# Altium project Gas_sensors_Rev. A.PrjPcb
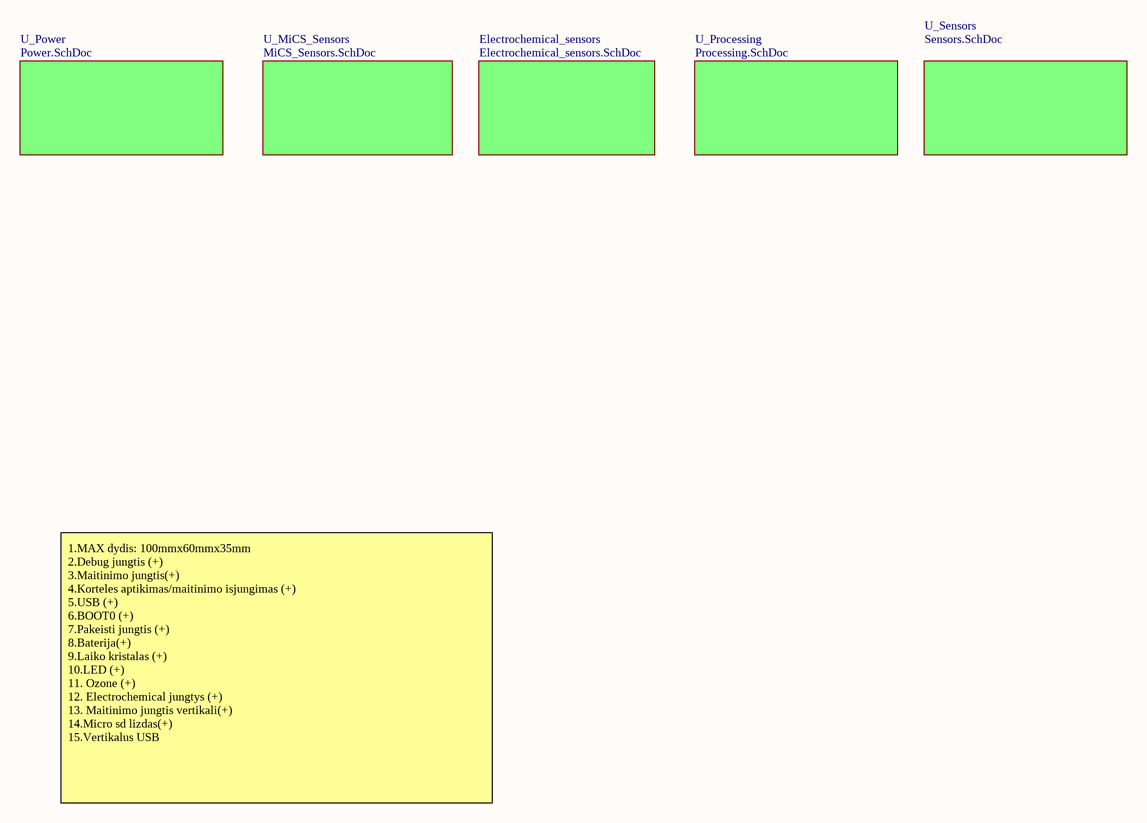
[diagram p0: Gas_sensors_top.SchDoc]
6 sheets, 109 parts. Net scope: flat (ports and power ports of the same name join across sheets).
Board file: PCB.PcbDoc
Sheets:
  Gas_sensors_top.SchDoc
    Electrochemical_sensors = Electrochemical_sensors.SchDoc
    U_MiCS_Sensors = MiCS_Sensors.SchDoc
    U_Power = Power.SchDoc
    U_Processing = Processing.SchDoc
    U_Sensors = Sensors.SchDoc

## Sheet Gas_sensors_top.SchDoc
size A4

### Sub-sheets
Electrochemical_sensors = Electrochemical_sensors.SchDoc: no entries
U_MiCS_Sensors = MiCS_Sensors.SchDoc: no entries
U_Power = Power.SchDoc: no entries
U_Processing = Processing.SchDoc: no entries
U_Sensors = Sensors.SchDoc: no entries

### Notes on the sheet
- 1.MAX dydis: 100mmx60mmx35mm
  2.Debug jungtis (+)
  3.Maitinimo jungtis(+)
  4.Korteles aptikimas/maitinimo isjungimas (+)
  5.USB (+)
  6.BOOT0 (+)
  7.Pakeisti jungtis (+)
  8.Baterija(+)
  9.Laiko kristalas (+)
  10.LED (+)
  11. Ozone (+)
  12. Electrochemical jungtys (+)
  13. Maitinimo jungtis vertikali(+)
  14.Micro sd lizdas(+)
  15.Vertikalus USB

## Sheet Electrochemical_sensors.SchDoc
size A4
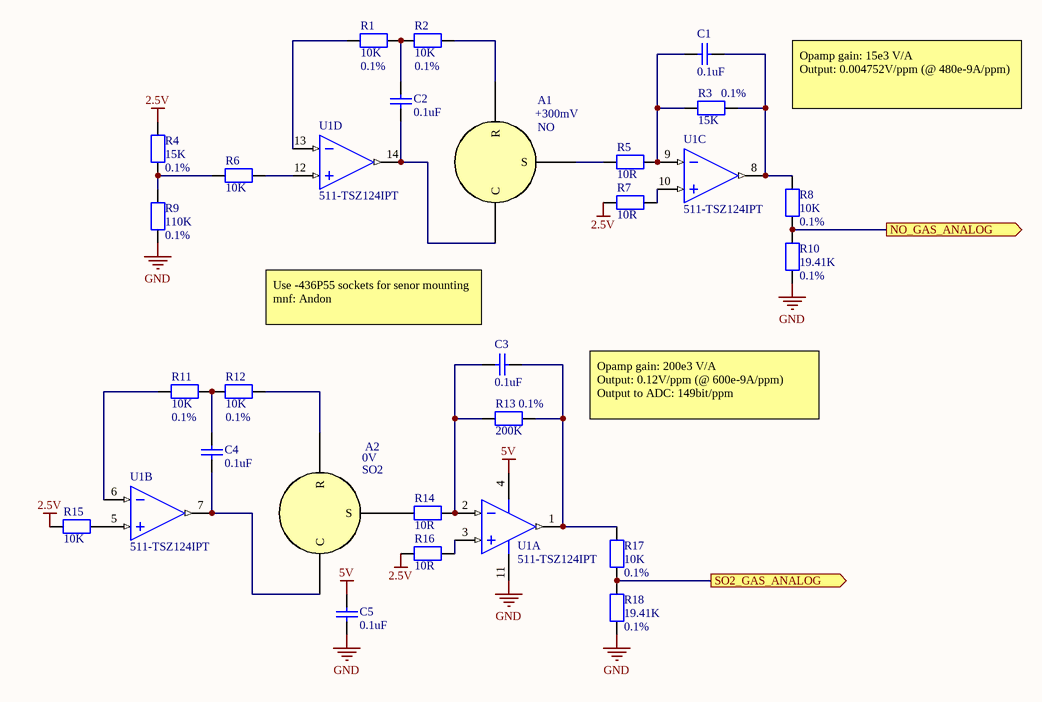
[diagram p1: Electrochemical_sensors.SchDoc]

### Parts
A1  Gas_type: NO  Potential: +300mV  [Electrochemical]  (hidden comment: Electrochemical sensors)
A2  Gas_type: SO2  Ptential: 0V  [Electrochemical]  (hidden comment: Electrochemical sensors)
C1  value 0.1uF  [0603_CAP]  (hidden comment: Capacitor)
C2  value 0.1uF  [0603_CAP]  (hidden comment: Capacitor)
C3  value 0.1uF  [0603_CAP]  (hidden comment: Capacitor)
C4  value 0.1uF  [0603_CAP]  (hidden comment: Capacitor)
C5  value 0.1uF  [0603_CAP]  (hidden comment: Capacitor)
R1  value 10K  Accuracy: 0.1%  [0603_RES]  (hidden comment: Resitor)
R2  value 10K  Accuracy: 0.1%  [0603_RES]  (hidden comment: Resitor)
R3  value 15K  Accuracy: 0.1%  [0603_RES]  (hidden comment: Resitor)
R4  value 15K  Accuracy: 0.1%  [0603_RES]  (hidden comment: Resitor)
R5  value 10R  [0603_RES]  (hidden comment: Resitor)
R6  value 10K  [0603_RES]  (hidden comment: Resitor)
R7  value 10R  [0603_RES]  (hidden comment: Resitor)
R8  value 10K  Accuracy: 0.1%  [0603_RES]  (hidden comment: Resitor)
R9  value 110K  Accuracy: 0.1%  [0603_RES]  (hidden comment: Resitor)
R10  value 19.41K  Accuracy: 0.1%  [0603_RES]  (hidden comment: Resitor)
R11  value 10K  Accuracy: 0.1%  [0603_RES]  (hidden comment: Resitor)
R12  value 10K  Accuracy: 0.1%  [0603_RES]  (hidden comment: Resitor)
R13  value 200K  Accuracy: 0.1%  [0603_RES]  (hidden comment: Resitor)
R14  value 10R  [0603_RES]  (hidden comment: Resitor)
R15  value 10K  [0603_RES]  (hidden comment: Resitor)
R16  value 10R  [0603_RES]  (hidden comment: Resitor)
R17  value 10K  Accuracy: 0.1%  [0603_RES]  (hidden comment: Resitor)
R18  value 19.41K  Accuracy: 0.1%  [0603_RES]  (hidden comment: Resitor)
U1  Supplier Part Number 1: 511-TSZ124IPT  [TSOP65P640X120-14M]  (hidden comment: TSZ124)  (parts A,B,C,D of 4)

### Ports
NO_GAS_ANALOG (out), SO2_GAS_ANALOG (out)

### Nets
2.5V: R4.2 R7.1 R15.1 R16.1
5V: C5.2 U1.4(V+)
GND: C5.1 R9.1 R10.1 R18.1 U1.11(V-)
NetA1_C: A1.C C2.1 U1.14(OUT4)
NetA1_R: A1.R R2.1
NetA1_S: A1.S R5.1
NetA2_C: A2.C C4.1 U1.7(OUT2)
NetA2_R: A2.R R12.1
NetA2_S: A2.S R14.1
NetC1_1: C1.1 R3.1 R8.2 U1.8(OUT3)
NetC1_2: C1.2 R3.2 R5.2 U1.9(IN3-)
NetC2_2: C2.2 R1.1 R2.2
NetC3_1: C3.1 R13.1 R17.2 U1.1(OUT1)
NetC3_2: C3.2 R13.2 R14.2 U1.2(IN1-)
NetC4_2: C4.2 R11.1 R12.2
NetR1_2: R1.2 U1.13(IN4-)
NetR4_1: R4.1 R6.1 R9.2
NetR6_2: R6.2 U1.12(IN4+)
NetR7_2: R7.2 U1.10(IN3+)
NetR8_1: R8.1 R10.2 ; port NO_GAS_ANALOG
NetR11_2: R11.2 U1.6(IN2-)
NetR15_2: R15.2 U1.5(IN2+)
NetR16_2: R16.2 U1.3(IN1+)
NetR17_1: R17.1 R18.2 ; port SO2_GAS_ANALOG

### Notes on the sheet
- Opamp gain: 15e3 V/A
  Output: 0.004752V/ppm (@ 480e-9A/ppm)
- (near C3) Use -436P55 sockets for senor mounting
  mnf: Andon
- Opamp gain: 200e3 V/A
  Output: 0.12V/ppm (@ 600e-9A/ppm)
  Output to ADC: 149bit/ppm

### Library data of the parts
A1 = Electrochemical_sensor: Max_sensetivity: 250ppm
A2 = Electrochemical_sensor: Max_sensetivity: 20ppm
C1-C5 = Capacitor: Max_V: 25V
U1 = TSZ124: Supplier 1: Mouser

## Sheet MiCS_Sensors.SchDoc
size A4
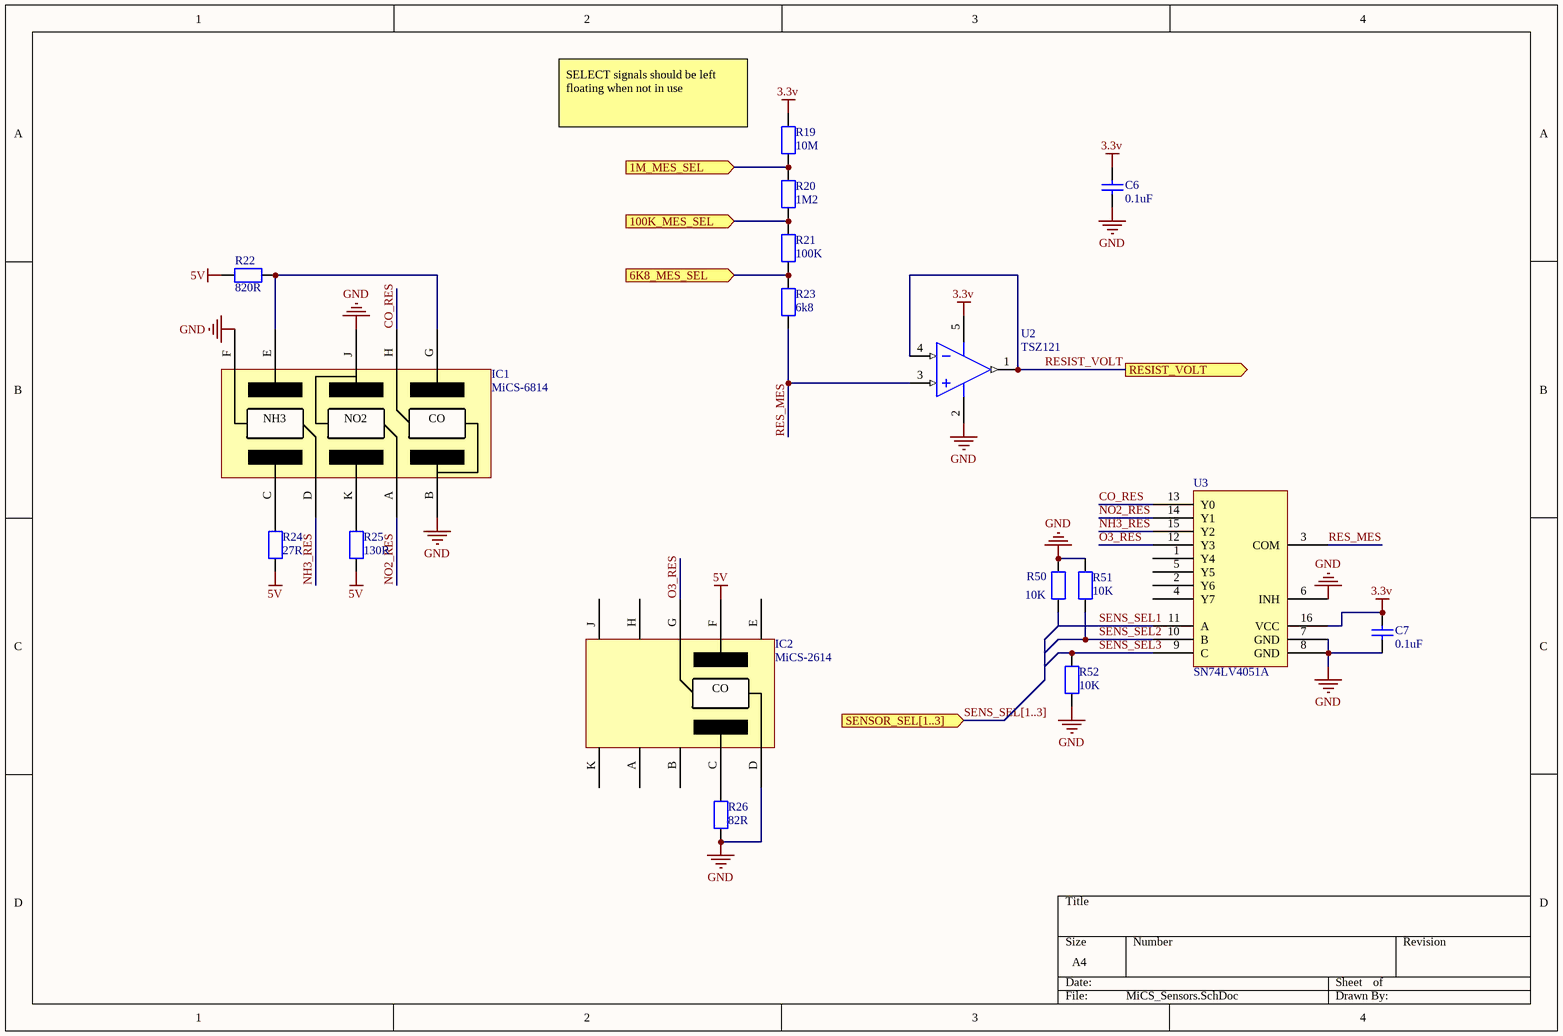
[diagram p2: MiCS_Sensors.SchDoc]

### Parts
C6  value 0.1uF  [0603_CAP]  (hidden comment: Capacitor)
C7  value 0.1uF  [0603_CAP]  (hidden comment: Capacitor)
IC1  MiCS-6814  [MiCS]
IC2  MiCS-2614  [MiCS]
R19  value 10M  [0603_RES]  (hidden comment: Resitor)
R20  value 1M2  [0603_RES]  (hidden comment: Resitor)
R21  value 100K  [0603_RES]  (hidden comment: Resitor)
R22  value 820R  [0603_RES]  (hidden comment: Resitor)
R23  value 6k8  [0603_RES]  (hidden comment: Resitor)
R24  value 27R  [0603_RES]  (hidden comment: Resitor)
R25  value 130R  [0603_RES]  (hidden comment: Resitor)
R26  value 82R  [0603_RES]  (hidden comment: Resitor)
R50  value 10K  [0603_RES]  (hidden comment: Resitor)
R51  value 10K  [0603_RES]  (hidden comment: Resitor)
R52  value 10K  [0603_RES]  (hidden comment: Resitor)
U2  TSZ121  [SOT95P280X145-5M]
U3  SN74LV4051A  [TSOP65P640X120-16M]

### Ports
1M_MES_SEL (in), 6K8_MES_SEL (in), 100K_MES_SEL (in), RESIST_VOLT (out), SENSOR_SEL[1..3] (in)

### Nets
3.3v: C6.2 C7.2 R19.2 U2.5(V+) U3.16(VCC)
5V: IC2.F R22.2 R24.1 R25.1
GND: C6.1 C7.1 IC1.B IC1.F IC1.J IC2.D R26.1 R50.2 R51.2 R52.1 U2.2(V-) U3.6(INH) U3.7(GND) U3.8(GND)
CO_RES: IC1.H U3.13(Y0)
NH3_RES: IC1.D U3.15(Y2)
NO2_RES: IC1.A U3.14(Y1)
O3_RES: IC2.G U3.12(Y3)
RES_MES: R23.1 U2.3(IN1+) U3.3(COM)
RESIST_VOLT: U2.1(OUT1) U2.4(IN1-) ; port RESIST_VOLT
SENS_SEL1: R50.1 U3.11(A)  [project net SEN_SEL1]
SENS_SEL2: R51.1 U3.10(B)  [project net SEN_SEL2]
SENS_SEL3: R52.2 U3.9(C)  [project net SEN_SEL3]
NetIC1_C: IC1.C R24.2
NetIC1_E: IC1.E IC1.G R22.1
NetIC1_K: IC1.K R25.2
NetIC2_C: IC2.C R26.2
NetR19_1: R19.1 R20.2 ; port 1M_MES_SEL
NetR20_1: R20.1 R21.2 ; port 100K_MES_SEL
NetR21_1: R21.1 R23.2 ; port 6K8_MES_SEL

Not connected (* = marked no-connect by the designer): IC2 A B E H J K; U3 1(Y4) 2(Y6) 4(Y7) 5(Y5)

### Buses and harness runs
bus SENS_SEL[1..3] = port SENSOR_SEL[1..3]

### Notes on the sheet
- (near R19) SELECT signals should be left floating when not in use
- (in symbol MiCS-5524) CO
- (in symbol MiCS-6814) NH3; NO2; CO

### Library data of the parts
C6 C7 = Capacitor: Max_V: 25V
IC2 = MiCS-5524
U3 = SN74LV4051A: Analog Multiplexer/Demultiplexer; ComponentLink1URL: http://www.ti.com.cn/cn/lit/ds/symlink/sn74lv4051a.pdf; ComponentLink1Description: Datasheet

## Sheet Power.SchDoc
size A4
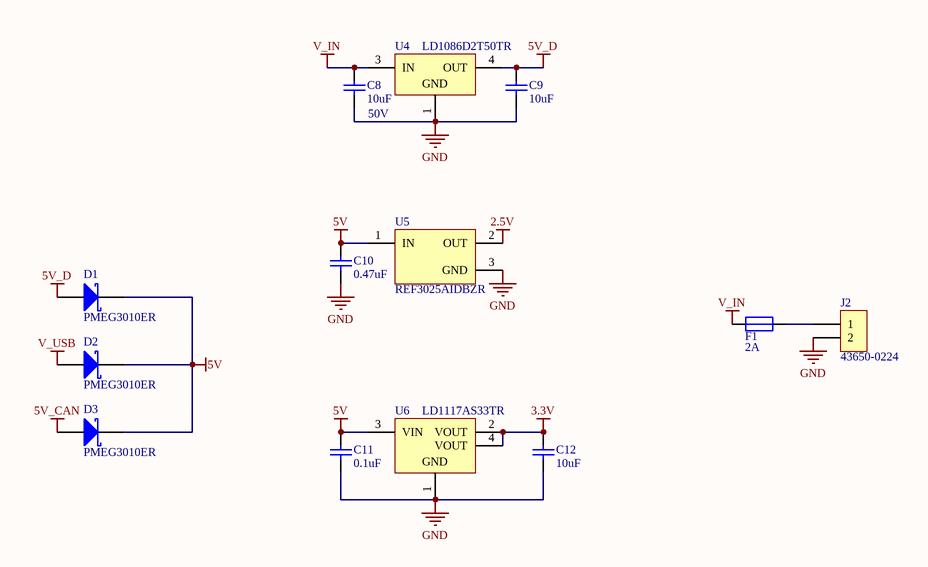
[diagram p3: Power.SchDoc]

### Parts
C8  value 10uF  Max_V: 50V  [1206_CAP]  (hidden comment: Capacitor)
C9  value 10uF  [1206_CAP]  (hidden comment: Capacitor)
C10  value 0.47uF  [0603_CAP]  (hidden comment: Capacitor)
C11  value 0.1uF  [0603_CAP]  (hidden comment: Capacitor)
C12  value 10uF  [1206_CAP]  (hidden comment: Capacitor)
D1  PMEG3010ER  [SOD123W]
D2  PMEG3010ER  [SOD123W]
D3  PMEG3010ER  [SOD123W]
F1  2A  [0603_RES]
J2  43650-0224  [43650-0224]
U4  LD1086D2T50TR  [TO-263_N]
U5  REF3025AIDBZR  [TI-DBZ3_N]
U6  LD1117AS33TR  [SOT-223_M]

### Nets
2.5V: U5.2(OUT)
3.3v: C12.2 U6.2(VOUT) U6.4(VOUT)
5V: C10.2 C11.2 D1.1(K) D2.1(K) D3.1(K) U5.1(IN) U6.3(VIN)
5V_CAN: D3.2(A)
5V_D: C9.2 D1.2(A) U4.4(OUT)
GND: C8.1 C9.1 C10.1 C11.1 C12.1 J2.2 U4.1(GND) U5.3(GND) U6.1(GND)
V_IN: C8.2 F1.1 U4.3(IN)
V_USB: D2.2(A)
NetF1_2: F1.2 J2.1

### Library data of the parts
C9 = Capacitor: Max_V: 50V
C10-C12 = Capacitor: Max_V: 25V
D1-D3 = D Schottky: Schottky Diode; Published: 8-Jun-2000; LatestRevisionDate: 17-Jul-2002; LatestRevisionNote: Re-released for DXP Platform.; PackageReference: SMB; Publisher: Altium Limited; PackageDescription: DO-214-AA/SMB; 2 C-Bend Leads; Body 5.3 x 3.6 mm, inc. leads (LxW); Code_JEDEC: DO-214-AA
F1 = Fuse
J2 = HEADER_POS2_?43650-0224: Molex - Micro-Fit 3.0 Series connector,  3.00mm (0.118") pitch header, 2 positions.; Supplier 1: Mouser; Supplier Part Number 1: 538-43650-0224
U4 = CMP-0244-00124-1: 1.5A, Low Drop Positive Voltage Regulator, 5.0V, 3-Pin D2PAK, Tape and Reel; DatasheetVersion: 11/07/2011; PackageReference: TO-263; ComponentLink1Description: Manufacturer URL; ComponentLink2URL: http://www.st.com/internet/com/TECHNICAL_RESOURCES/TECHNICAL_LITERATURE/DATASHEET/CD00001884.pdf; PackageDescription: 3-Pin Transistor Outline Package 2.54 mm Pitch, 15.4 mm Lead Span (D2PAK); ComponentLink2Description: Datasheet; PackageVersion: 2011; ComponentLink1URL: http://www.st.com
U5 = CMP-0367-00155-1: 2.5 V, 50 ppm / degC, 50 uA Series (Bandgap) Voltage Reference, -40 to 125 degC, 3-pin SOT-23 (DBZ), Green (RoHS & no Sb/Br); Manufacturer: Texas Instruments; Rating: Catalog; VI(Max)(V): 5.5; Temp Coeff(Typ)(ppm/ degree C): 20; Temp Coeff(Max)(ppm/ degree C): 50; VI(Min)(V): 2.501; VO(V): 2.5; Initial Accuracy @ 25/deg C(%): 0.2; SubFamily: Series Voltage Reference; PackageDescription: 3-Pin Plastic Small Outline, Body 2.92 x 1.3 mm, Pitch 0.95 mm; PartNumber: REF3025AIDBZR; DatasheetVersion: SBVS032F; PackageVersion: 4203227/B; ComponentLink2URL: http://www.ti.com/general/docs/lit/getliterature.tsp?genericPartNumber=REF3025&fileType=pdf; Code_JEDEC: TO-236; PackageReference: DBZ3; ComponentLink1Description: Manufacturer URL; ComponentLink3URL: http://www.ti.com/litv/pdf/mpds108a; Iq(Max)(uA): 50; ComponentLink1URL: http://www.ti.com/; ComponentLink2Description: Datasheet; Mounting Technology: Surface Mount; Eco-Plan: Green (RoHS & no Sb/Br); ComponentLink3Description: Package Specification
U6 = CMP-0244-00316-1: 1A, Low Drop Positive Voltage Regulator, 3.3V, 4-Pin SOT-223, Tape and Reel; ComponentLink1Description: Manufacturer URL; DatasheetVersion: 2/12/2011; PackageVersion: 2010; ComponentLink1URL: http://www.st.com; ComponentLink2Description: Datasheet; ComponentLink2URL: http://www.st.com/internet/com/TECHNICAL_RESOURCES/TECHNICAL_LITERATURE/DATASHEET/CD00002116.pdf; PackageDescription: 4-Pin SOT-223 Package, 6.5 x 3.5 mm Body, 2.3 mm Pitch, 7 mm Lead Span; PackageReference: SOT-223

## Sheet Processing.SchDoc
size A4
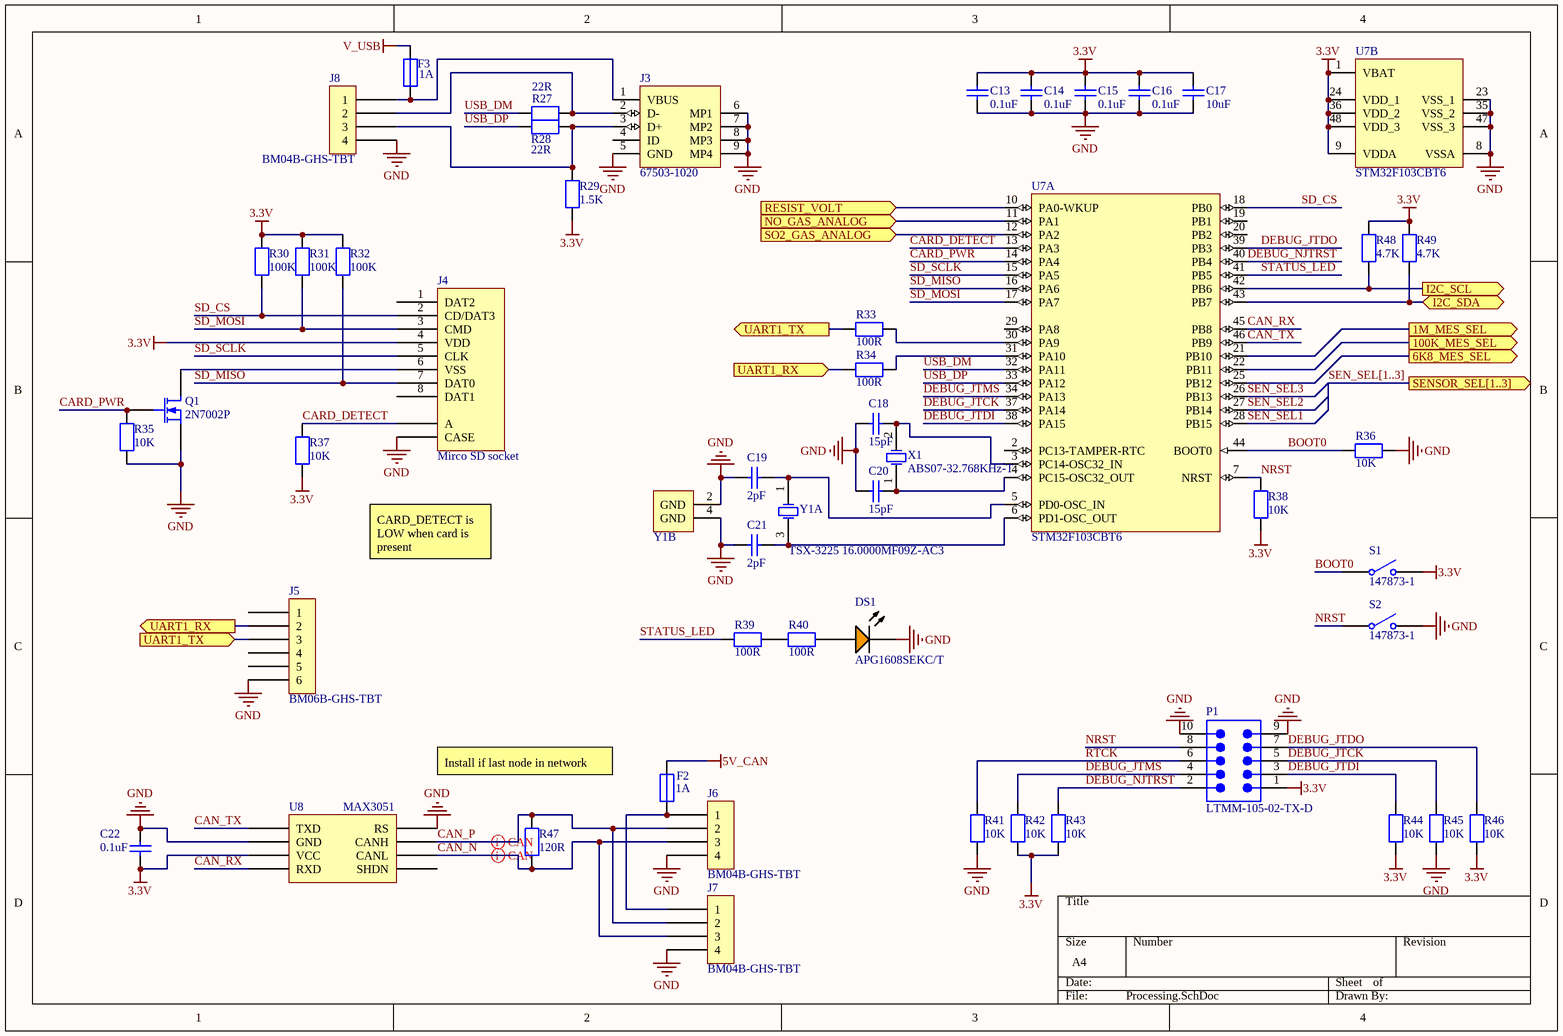
[diagram p4: Processing.SchDoc]

### Parts
C13  value 0.1uF  [0603_CAP]  (hidden comment: Capacitor)
C14  value 0.1uF  [0603_CAP]  (hidden comment: Capacitor)
C15  value 0.1uF  [0603_CAP]  (hidden comment: Capacitor)
C16  value 0.1uF  [0603_CAP]  (hidden comment: Capacitor)
C17  value 10uF  [1206_CAP]  (hidden comment: Capacitor)
C18  value 15pF  [0603_CAP]  (hidden comment: Capacitor)
C19  value 2pF  [0603_CAP]  (hidden comment: Capacitor)
C20  value 15pF  [0603_CAP]  (hidden comment: Capacitor)
C21  value 2pF  [0603_CAP]  (hidden comment: Capacitor)
C22  value 0.1uF  [0603_CAP]  (hidden comment: Capacitor)
DS1  APG1608SEKC/T  [KING-LED0603-25-ORANGE_V]
F2  Max_A: 1A  [0603_RES]  (hidden comment: Fuse)
F3  Max_A: 1A  [0603_RES]  (hidden comment: Fuse)
J3  67503-1020  [MOLX-67503-1020_V]
J4  Mirco SD socket  [HRS_DM3CS-SF]
J5  BM06B-GHS-TBT  [BM06B-GHS-TBT]
J6  BM04B-GHS-TBT  [BM04B-GHS-TBT]
J7  BM04B-GHS-TBT  [BM04B-GHS-TBT]
J8  BM04B-GHS-TBT  [BM04B-GHS-TBT]
P1  LTMM-105-02-TX-D  [SMTC-LTMM-105-02-XX-D]
Q1  PartNumber: 2N7002P  [SOT95P230X110-3M]  (hidden comment: N-channel MOSFET)
R27  value 22R  [0603_RES]  (hidden comment: Resitor)
R28  value 22R  [0603_RES]  (hidden comment: Resitor)
R29  value 1.5K  [0603_RES]  (hidden comment: Resitor)
R30  value 100K  [0603_RES]  (hidden comment: Resitor)
R31  value 100K  [0603_RES]  (hidden comment: Resitor)
R32  value 100K  [0603_RES]  (hidden comment: Resitor)
R33  value 100R  [0603_RES]  (hidden comment: Resitor)
R34  value 100R  [0603_RES]  (hidden comment: Resitor)
R35  value 10K  [0603_RES]  (hidden comment: Resitor)
R36  value 10K  [0603_RES]  (hidden comment: Resitor)
R37  value 10K  [0603_RES]  (hidden comment: Resitor)
R38  value 10K  [0603_RES]  (hidden comment: Resitor)
R39  value 100R  [0603_RES]  (hidden comment: Resitor)
R40  value 100R  [0603_RES]  (hidden comment: Resitor)
R41  value 10K  [0603_RES]  (hidden comment: Resitor)
R42  value 10K  [0603_RES]  (hidden comment: Resitor)
R43  value 10K  [0603_RES]  (hidden comment: Resitor)
R44  value 10K  [0603_RES]  (hidden comment: Resitor)
R45  value 10K  [0603_RES]  (hidden comment: Resitor)
R46  value 10K  [0603_RES]  (hidden comment: Resitor)
R47  value 120R  [0603_RES]  (hidden comment: Resitor)
R48  value 4.7K  [0603_RES]  (hidden comment: Resitor)
R49  value 4.7K  [0603_RES]  (hidden comment: Resitor)
S1  147873-1  [147873-1]
S2  147873-1  [147873-1]
U7  STM32F103CBT6  [STM-LQFP48_L]  (parts A,B of 2)
U8  MAX3051  [SOIC127P600X175-8M]
X1  ABS07-32.768KHz-T  [ABRA-ABS07-2_V]
Y1  TSX-3225 16.0000MF09Z-AC3  [TSX-3225]  (parts A,B of 2)

### Ports
1M_MES_SEL (out), 6K8_MES_SEL (out), 100K_MES_SEL (out), I2C_SCL (out), I2C_SDA (bidir), NO_GAS_ANALOG (in), RESIST_VOLT (in), SENSOR_SEL[1..3] (out), SO2_GAS_ANALOG (in), UART1_RX (in), UART1_RX (out), UART1_TX (in), UART1_TX (out)

### Nets
3.3v: C13.2 C14.2 C15.2 C16.2 C17.2 C22.1 J4.4(VDD) P1.1 R29.1 R30.2 R31.2 R32.2 R37.2 R38.1 R42.1 R43.2 R44.2 R46.1 R48.2 R49.2 S1.2(NO) U7.1(VBAT) U7.9(VDDA) U7.24(VDD_1) U7.36(VDD_2) U7.48(VDD_3) U8.3(VCC)
5V_CAN: F2.2
GND: C13.1 C14.1 C15.1 C16.1 C17.1 C18.1 C19.1 C20.1 C21.1 C22.2 DS1.2(K) J3.5(GND) J3.6(MP1) J3.7(MP2) J3.8(MP3) J3.9(MP4) J4.0(CASE) J5.6 J6.4 J7.4 J8.4 P1.9 P1.10 Q1.3(S) R35.2 R36.1 R41.1 R45.2 S2.2(NO) U7.8(VSSA) U7.23(VSS_1) U7.35(VSS_2) U7.47(VSS_3) U8.2(GND) U8.8(RS) Y1.2(GND) Y1.4(GND)
V_USB: F3.2
BOOT0: R36.2 S1.1(COMMON) U7.44(BOOT0)
CAN_N: J6.3 J7.3 R47.1 U8.6(CANL)
CAN_P: J6.2 J7.2 R47.2 U8.7(CANH)
CAN_RX: U7.45(PB8) U8.4(RXD)
CAN_TX: U7.46(PB9) U8.1(TXD)
CARD_DETECT: J4.A R37.1 U7.13(PA3)
CARD_PWR: Q1.2(G) R35.1 U7.14(PA4)
DEBUG_JTCK: P1.5 R45.1 U7.37(PA14)
DEBUG_JTDI: P1.3 R44.1 U7.38(PA15)
DEBUG_JTDO: P1.7 R46.2 U7.39(PB3)
DEBUG_JTMS: P1.4 R42.2 U7.34(PA13)
DEBUG_NJTRST: P1.2 R43.1 U7.40(PB4)
NRST: P1.8 R38.2 S2.1(COMMON) U7.7(NRST)
RESIST_VOLT: U7.10(PA0-WKUP) ; port RESIST_VOLT
RTCK: P1.6 R41.2
SD_CS: J4.2(CD/DAT3) R30.1 U7.18(PB0)
SD_MISO: J4.7(DAT0) R32.1 U7.16(PA6)
SD_MOSI: J4.3(CMD) R31.1 U7.17(PA7)
SD_SCLK: J4.5(CLK) U7.15(PA5)
SEN_SEL1: U7.28(PB15)
SEN_SEL2: U7.27(PB14)
SEN_SEL3: U7.26(PB13)
STATUS_LED: R39.1 U7.41(PB5)
USB_DM: R27.1 U7.32(PA11)
USB_DP: R28.1 U7.33(PA12)
NetC18_2: C18.2 U7.3(PC14-OSC32_IN) X1.2(X2)
NetC19_2: C19.2 U7.5(PD0-OSC_IN) Y1.1(X1)
NetC20_2: C20.2 U7.4(PC15-OSC32_OUT) X1.1(X1)
NetC21_2: C21.2 U7.6(PD1-OSC_OUT) Y1.3(X2)
NetDS1_1: DS1.1(A) R40.2
NetF2_1: F2.1 J6.1 J7.1
NetF3_1: F3.1 J3.1(VBUS) J8.1
NetJ3_2: J3.2(D-) J8.2 R27.2
NetJ3_3: J3.3(D+) J8.3 R28.2 R29.2
NetJ4_6: J4.6(VSS) Q1.1(D)
NetJ5_2: J5.2 R34.1 ; port UART1_RX
NetJ5_3: J5.3 R33.1 ; port UART1_TX
NetR8_1: U7.11(PA1) ; port NO_GAS_ANALOG
NetR17_1: U7.12(PA2) ; port SO2_GAS_ANALOG
NetR19_1: U7.21(PB10) ; port 1M_MES_SEL
NetR20_1: U7.22(PB11) ; port 100K_MES_SEL
NetR21_1: U7.25(PB12) ; port 6K8_MES_SEL
NetR33_2: R33.2 U7.30(PA9)
NetR34_2: R34.2 U7.31(PA10)
NetR39_2: R39.2 R40.1
NetR48_1: R48.1 U7.42(PB6) ; port I2C_SCL
NetR49_1: R49.1 U7.43(PB7) ; port I2C_SDA

Not connected (* = marked no-connect by the designer): J3 4(ID); J4 1(DAT2) 8(DAT1); J5 1 4 5; U7 2(PC13-TAMPER-RTC) 19(PB1) 20(PB2) 29(PA8); U8 5(SHDN)

### Buses and harness runs
bus SEN_SEL[1..3] = port SENSOR_SEL[1..3]

### Layout directives
differential pair: CAN_N, CAN_P

### Notes on the sheet
- CARD_DETECT is LOW when card is present
- Install if last node in network

### Library data of the parts
C13-C22 = Capacitor: Max_V: 25V
DS1 = CMP-0239-00002-1: LED, SMT, 0603(1608), 0.25mm Tthickness, Super Bright Orange; Forward Current: 30 mA; Power Dissipation: 75 mW; Reverse Voltage: 5 V; Packing: Reel; PackageDescription: 2-Pin SMT LED, 1.6 x 0.8 mm Body, 0.25mm Thickness; ComponentLink1URL: http://www.kingbrightusa.com/; PackageVersion: Rev. 4A, 12/2011; Storage Temperature: -40 to 85 degC; PartNumber: APG1608SEKC/T; Mounting Technology: Surface Mount; ComponentLink2Description: Datasheet; DatasheetVersion: Rev. 4A, 12/2011; ComponentLink2URL: http://www.kingbrightusa.com/images/catalog/SPEC/APG1608SEKC-T.pdf; PackageReference: LED0603-25-ORANGE; ComponentLink1Description: Manufacturer URL
J3 = CMP-0411-00002-1: USB, MINI, SMD, RA KME04-USBMU03A01; Manufacturer: Molex; ComponentLink1URL: http://www.molex.com/; PartNumber: 67503-1020; Mounting Technology: Surface Mount; ComponentLink1Description: Manufacturer URL; Terminal Pitch: 0.8 mm; DatasheetVersion: Rev F, 06/2009; ComponentLink2Description: Datasheet; PackageDescription: Mini USB Connector, SMT, Righer Angle; ComponentLink2URL: http://www.molex.com/pdm_docs/sd/675031020_sd.pdf; PackageReference: 67503-1020
J4 = Micro_SD
J5 = BM06B-GHS-TBT: JST GH top entry SMD connector; Supplier 1: Digi-Key; Supplier Part Number 1: 455-1582-1-ND
J6-J8 = BM04B-GHS-TBT: JST GH top entry SMD connector; Supplier 1: Farnell; Supplier Part Number 1: 1516208
P1 = CMP-1028-00010-1: Shrouded Header & Stacker, Through-Hole, Vertical, -55 to 105 degC, 2 mm Pitch, 10-Pin, Male, RoHS; Manufacturer: Samtec; Pitch: 2 mm; RoHS: True; Temperature Range: -55 to 105 degC; PackageVersion: AQ, 5/1992; DatasheetVersion: F-214; ComponentLink1Description: Manufacturer URL; ComponentLink2Description: Datasheet; ComponentLink3Description: Package Specification; Mounting Technology: Through-hole; Orientation: Vertical; ComponentLink3URL: http://www.samtec.com/documents/webfiles/cpdf/LTMM-1XX-XX-XX-D-XX-XX-MKT.pdf; PackageReference: LTMM-105-02-XX-D; PackageDescription: LTMM Assembly; ComponentLink2URL: http://d2a072wq521u33.cloudfront.net/catalog_english//LTMM.PDF; PartNumber: LTMM-105-02-TX-D; ComponentLink1URL: http://www.samtec.com
Q1 = MOSFET-N
S1 S2 = SW-SPST: Single-Pole, Single-Throw Switch; Published: 24-Mar-1999; LatestRevisionDate: 17-Jul-2002; LatestRevisionNote: Re-released for DXP Platform.; PackageReference: SPST-2; Publisher: Altium Limited; PackageDescription: Switch; 2 Leads; Supplier 1: Newark; Supplier Part Number 1: 23R8896
U7 = CMP-0237-00250-3: ARM Cortex-M3 32-bit MCU, 128 KB Flash, 20 KB Internal RAM, 37 I/Os, 48-pin LQFP, -40 to 85 degC, Tray; Supply Voltage(Vcc) min (V): 2; Operating Frequency(F) (Processor speed) (MHz): 72; A/D Converter: 2x12-bit (10 Channel); FLASH Size (Prog) (kB): 128; Internal RAM Size (kB): 20; I/Os (High Current): 37; ComponentLink2Description: Datasheet; PackageReference: LQFP48; PartNumber: STM32F103CBT6; ComponentLink1Description: Manufacturer URL; DatasheetVersion: Rev. 16; PackageVersion: Rev. 6, 06/2013; Packing: Tray; ComponentLink1URL: http://www.st.com/web/en/home.html; Mounting Technology: Surface Mount; ComponentLink3URL: http://www.st.com/st-web-ui/static/active/en/resource/technical/document/datasheet/DM00058181.pdf; PackageDescription: 48-Pin Low Profile Quad Flat Package, 7 x 7 mm Body, 0.5 mm Pitch; Core: ARM Cortex-M3; ComponentLink3Description: Package Specification; ComponentLink2URL: http://www.st.com/st-web-ui/static/active/en/resource/technical/document/datasheet/CD00161566.pdf
X1 = CMP-0447-00001-2: Crystal, 32.768 kHz, 12.5 pF, -40 to 85 degC, SMD Low Profile 3.2 x 1.5 x 0.9 mm, Tape and Reel; Manufacturer: Abracon; Q Value (Type): 30000; Operation Mode: Flexural Mode (Tuning Fork); Shunt Capacitance (C0): 0.9 to 1.2 pF; Load Capacitance (CL): 12.5 pF; Frequency Tolerance @+25degC: +/- 20 ppm; Drive Level (Type): 0.1 uW; Equivalent Series Resistance (R1): 70 Kohm; Insulation Resistance (Min): 500 Mohm; ComponentLink3URL: http://www.abracon.com/Resonators/ABS07.pdf; PackageDescription: 2-Pin Hand Drawn, Body 3.2x1.5mm, Pitch 2.5mm; Operating Temperature: -40 to 85 degC; ComponentLink2URL: http://www.abracon.com/Resonators/ABS07.pdf; PackageReference: ABS07-2; ComponentLink3Description: Package Specification; ComponentLink1Description: Manufacturer URL; DatasheetVersion: 04.03.13; Mounting Technology: Surface Mount; ComponentLink2Description: Datasheet; ComponentLink1URL: http://www.abracon.com/; PartNumber: ABS07-32.768KHz-T; Packing: Tape and Reel; Frequency: 32.768 kHz

## Sheet Sensors.SchDoc
size A4
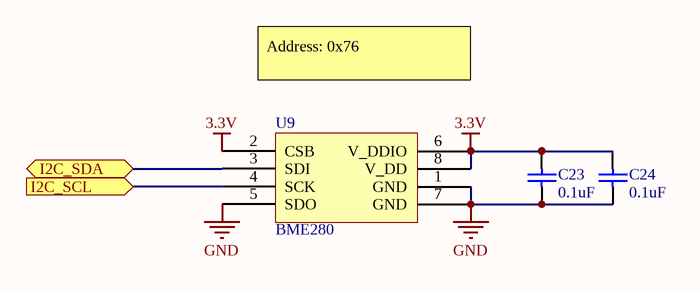
[diagram p5: Sensors.SchDoc]

### Parts
C23  value 0.1uF  [0603_CAP]  (hidden comment: Capacitor)
C24  value 0.1uF  [0603_CAP]  (hidden comment: Capacitor)
U9  BME280  [BME280]

### Ports
I2C_SCL (in), I2C_SDA (bidir)

### Nets
3.3v: C23.2 C24.2 U9.2(CSB) U9.6(V_DDIO) U9.8(V_DD)
GND: C23.1 C24.1 U9.1(GND) U9.5(SDO) U9.7(GND)
NetR48_1: U9.4(SCK) ; port I2C_SCL
NetR49_1: U9.3(SDI) ; port I2C_SDA

### Notes on the sheet
- Address: 0x76

### Library data of the parts
C23 C24 = Capacitor: Max_V: 25V
U9 = BME280: Combined humidity and pressure sensor; Supplier 1: Mouser; Supplier Part Number 1: 262-BME280

## Nets that join several sheets
2.5V: Electrochemical_sensors (R4.2 R7.1 R15.1 R16.1), Power (U5.2)
3.3v: MiCS_Sensors (5 pins), Power (C12.2 U6.2 U6.4), Processing (27 pins), Sensors (5 pins)
5V: Electrochemical_sensors (C5.2 U1.4), MiCS_Sensors (IC2.F R22.2 R24.1 R25.1), Power (7 pins)
5V_CAN: Power (D3.2), Processing (F2.2)
GND: Electrochemical_sensors (5 pins), MiCS_Sensors (14 pins), Power (9 pins), Processing (37 pins), Sensors (5 pins)
V_USB: Power (D2.2), Processing (F3.2)
NetR8_1: Electrochemical_sensors (R8.1 R10.2), Processing (U7.11)
NetR17_1: Electrochemical_sensors (R17.1 R18.2), Processing (U7.12)
NetR19_1: MiCS_Sensors (R19.1 R20.2), Processing (U7.21)
NetR20_1: MiCS_Sensors (R20.1 R21.2), Processing (U7.22)
NetR21_1: MiCS_Sensors (R21.1 R23.2), Processing (U7.25)
NetR48_1: Processing (R48.1 U7.42), Sensors (U9.4)
NetR49_1: Processing (R49.1 U7.43), Sensors (U9.3)
RESIST_VOLT: MiCS_Sensors (U2.1 U2.4), Processing (U7.10)
SEN_SEL1: MiCS_Sensors (R50.1 U3.11), Processing (U7.28)
SEN_SEL2: MiCS_Sensors (R51.1 U3.10), Processing (U7.27)
SEN_SEL3: MiCS_Sensors (R52.2 U3.9), Processing (U7.26)